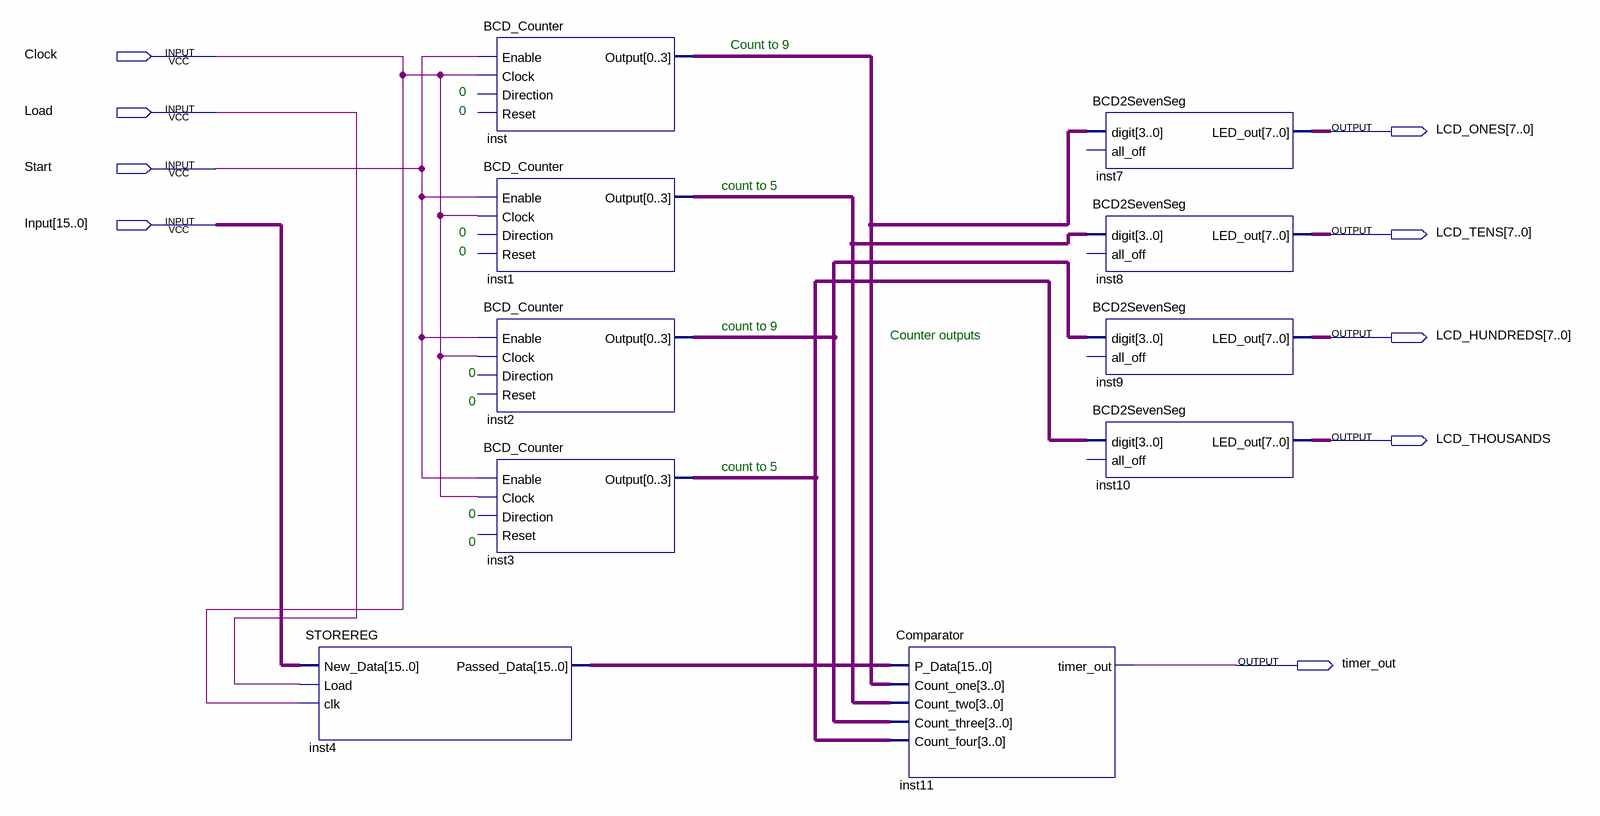
[diagram p0: schematic sheet]
// Quartus schematic Idea.bdf as structural Verilog: 10 symbols, 9 pins
module Idea (
  input  Clock,
  input  Load,
  input  Start,
  input  [15:0] Input,
  output [7:0] LCD_ONES,
  output [7:0] LCD_TENS,
  output [7:0] LCD_HUNDREDS,
  output LCD_THOUSANDS,
  output timer_out
);

  wire [3:0] inst1_output, inst2_output, inst3_output, inst_output;
  wire [7:0] inst10_led_out;
  wire [15:0] inst4_passed_data;

  STOREREG inst4 (.New_Data(Input), .Load(Load), .clk(Clock), .Passed_Data(inst4_passed_data));
  BCD_Counter inst (.Enable(Start), .Clock(Clock), .Output(inst_output));  // open: Direction, Reset
  BCD_Counter inst1 (.Enable(Start), .Clock(Clock), .Output(inst1_output));  // open: Direction, Reset
  BCD_Counter inst2 (.Enable(Start), .Clock(Clock), .Output(inst2_output));  // open: Direction, Reset
  BCD_Counter inst3 (.Enable(Start), .Clock(Clock), .Output(inst3_output));  // open: Direction, Reset
  Comparator inst11 (
    .P_Data(inst4_passed_data), .Count_one(inst_output), .Count_two(inst1_output),
    .Count_three(inst2_output), .Count_four(inst3_output), .timer_out(timer_out));
  BCD2SevenSeg inst7 (.digit(inst_output), .LED_out(LCD_ONES));  // open: all_off
  BCD2SevenSeg inst8 (.digit(inst1_output), .LED_out(LCD_TENS));  // open: all_off
  BCD2SevenSeg inst9 (.digit(inst2_output), .LED_out(LCD_HUNDREDS));  // open: all_off
  BCD2SevenSeg inst10 (.digit(inst3_output), .LED_out(inst10_led_out));  // open: all_off

  // Notes on the sheet:
  //   Count to 9
  //   0
  //   0
  //   count to 5
  //   0
  //   0
  //   count to 9
  //   Counter outputs
  //   0
  //   0
  //   count to 5
  //   0
  //   0
endmodule
